# Altium schematic sheet PowerSupply.SchDoc
size A3; SheetNumber: 1; SheetTotal: 9
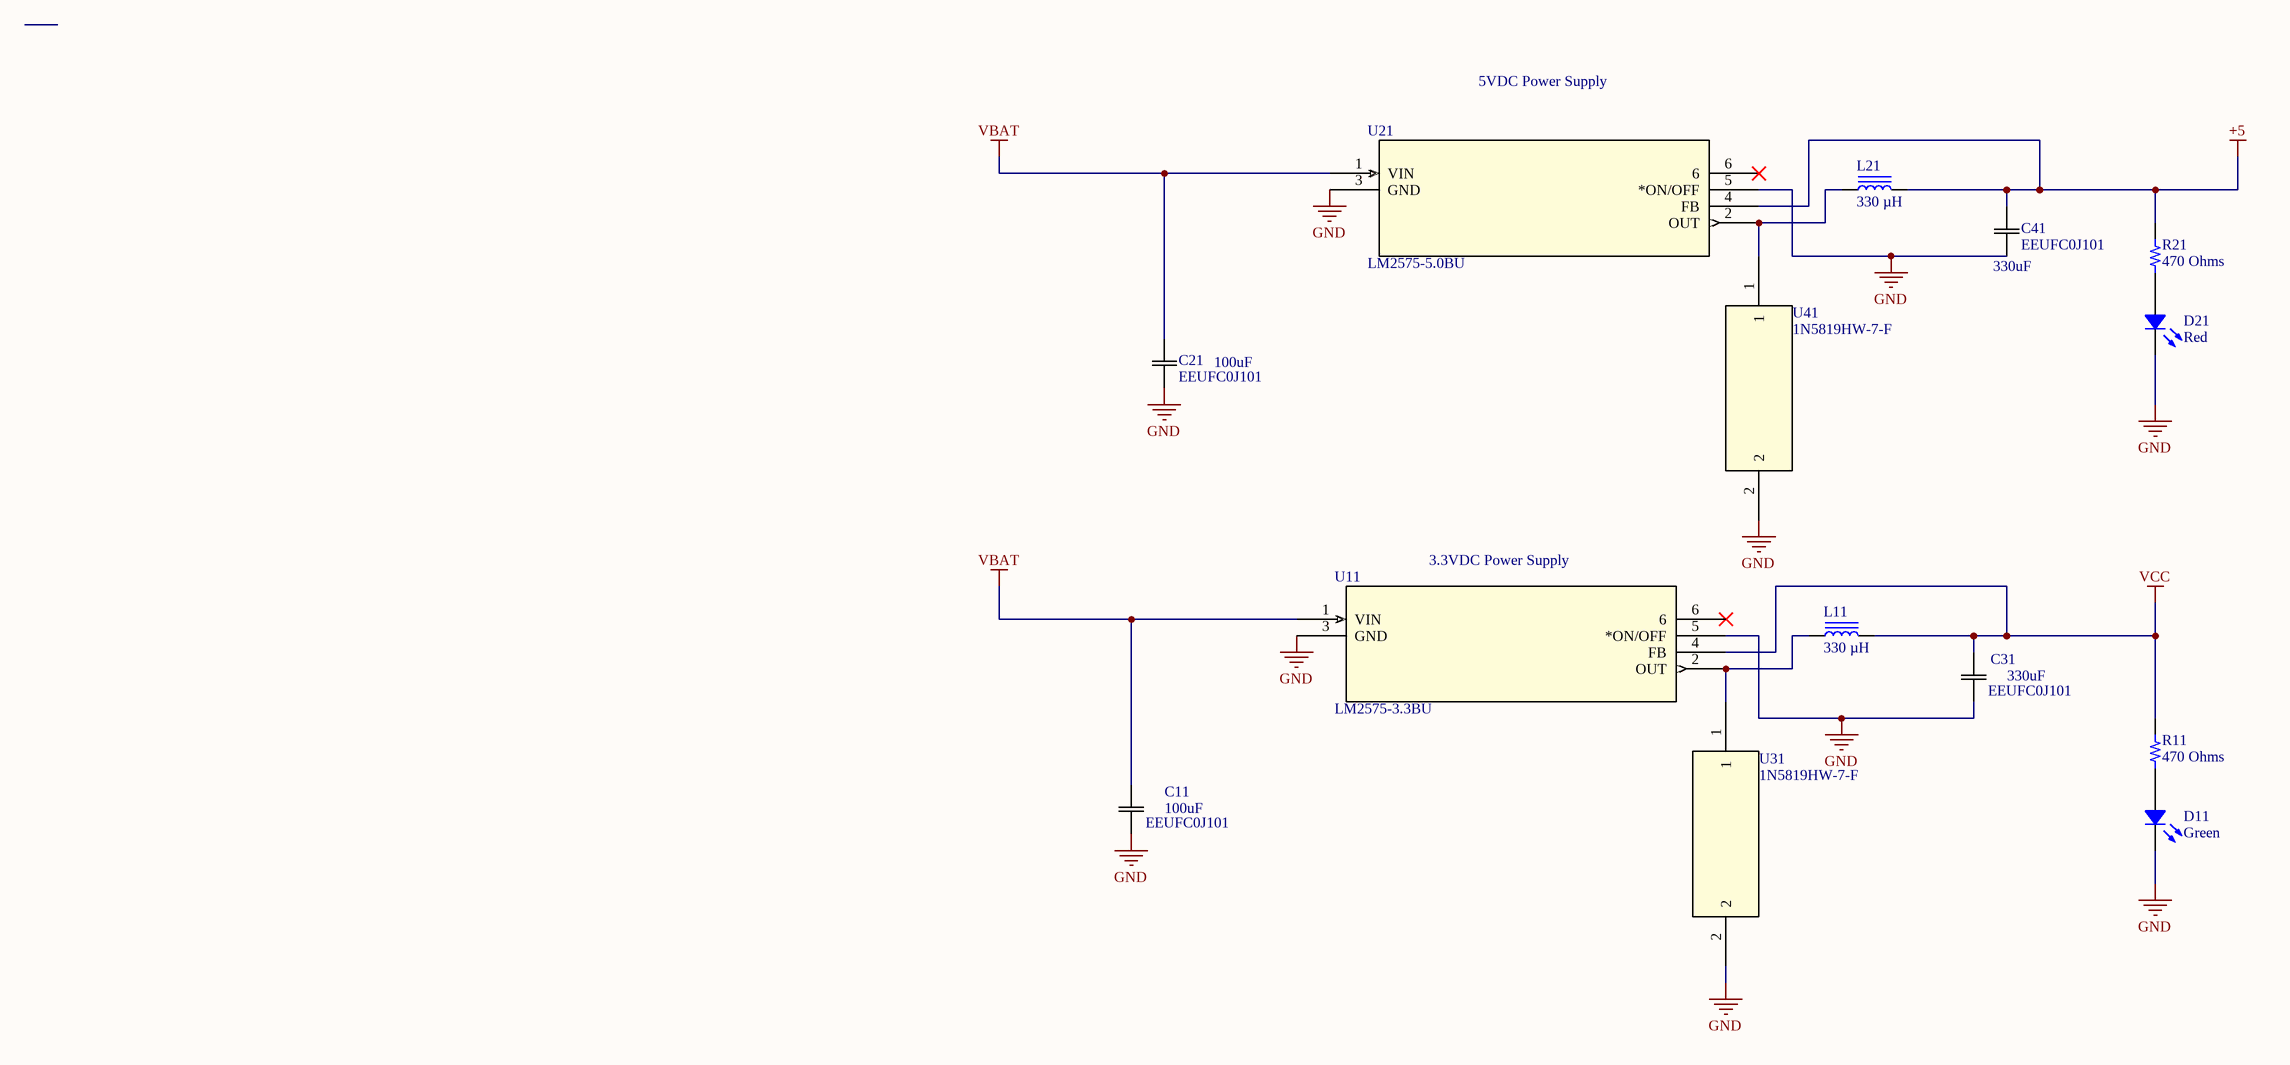
[diagram p0: PowerSupply.SchDoc]

## Parts
C11  EEUFC0J101  value 100uF  [CAP_5 X 11_PAN]
C21  EEUFC0J101  value 100uF  [CAP_5 X 11_PAN]
C31  EEUFC0J101  value 330uF  [CAP_5 X 11_PAN]
C41  EEUFC0J101  value 330uF  [CAP_5 X 11_PAN]
D11  Green  [LED 1206_3216 GREEN]
D21  Red  [LED 1206_3216 RED]
L11  330 µH  [BOURNS SRR1280]
L21  330 µH  [BOURNS SRR1280]
R11  470 Ohms  [RES 0805_2012]
R21  470 Ohms  [RES 0805_2012]
U11  LM2575-3.3BU  [TO-263-5_MCL]
U21  LM2575-5.0BU  [TO-263-5_MCL-M]
U31  1N5819HW-7-F  [1N5819HW-7-F_DIO]
U41  1N5819HW-7-F  [1N5819HW-7-F_DIO]

## Nets
+5: C41.1 L21.2 R21.2 U21.4(FB)
GND: C11.2 C21.2 C31.2 C41.2 D11.2 D21.2 U11.3(GND) U11.5(*ON/OFF) U21.3(GND) U21.5(*ON/OFF) U31.2 U41.2
VBAT: C11.1 C21.1 U11.1(VIN) U21.1(VIN)
VCC: C31.1 L11.2 R11.2 U11.4(FB)
NetD11_1: D11.1 R11.1
NetD21_1: D21.1 R21.1
NetL11_1: L11.1 U11.2(OUT) U31.1
NetL21_1: L21.1 U21.2(OUT) U41.1

Not connected (* = marked no-connect by the designer): U11 6*; U21 6*

## Notes on the sheet
- 5VDC Power Supply
- (near U11) 3.3VDC Power Supply

## Library data of the parts
C11 C21 C31 C41 = EEUFC0J101: No Description Available; Mfr_Name: Panasonic
D11 = 597-6322-107F: LED GREEN 1206 SMD; Manufacturer: Dialight; Current - Test: 20mA; Lens Size: 1.20mm Dia; Lens Style: Round with Domed Top; Millicandela Rating: 1278.5mcd; Viewing Angle: 30°; Voltage - Forward (Vf) (Typ): 3.2V; Wavelength - Dominant: 525nm; Part Number: 597-6322-107F; Color: Green; ComponentLink1Description: Datasheet; ComponentLink1URL: https://s3-us-west-2.amazonaws.com/catsy.557/C18571.pdf; ComponentLink2Description: DigiKey Link; ComponentLink2URL: https://www.digikey.com/en/products/detail/dialight/597-6322-107F/16995758; Device Package: 1206 (3216 Metric); Height (Max): 1.73mm; LastUpdated: 6/3/2024 19:59:09; Lifecycle Status: Active; Minimum Order: 1; Mounting Type: Surface Mount; Package / Case: 1206 (3216 Metric); Packaging: TapeAndReel; PartId: 1292; Part Status: Active; Price: 0.17; Series: -; Size / Dimension: 3.20mm L x 1.60mm W; Supplier 1: DigiKey; Supplier Part Number 1: 350-597-6322-107FCT-ND; Supplier Device Package: 1206; Value: Green
D21 = 25-21/R6C-BR2S2B/2A: LED RED CLEAR 1206 SMD; Manufacturer: Everlight Electronics Co Ltd; Current - Test: 20mA; Lens Color: Colorless; Lens Size: 1.10mm Dia; Lens Style: Round with Domed Top; Millicandela Rating: 212.5mcd; Viewing Angle: 60°; Voltage - Forward (Vf) (Typ): 2.05V; Wavelength - Dominant: 624nm; Wavelength - Peak: 632nm; Part Number: 25-21/R6C-BR2S2B/2A; Color: Red; ComponentLink1Description: Datasheet; ComponentLink1URL: https://everlighteurope.com/index.php?controller=attachment&id_attachment=6134; ComponentLink2Description: DigiKey Link; ComponentLink2URL: https://www.digikey.com/en/products/detail/everlight-electronics-co-ltd/25-21-R6C-BR2S2B-2A/12177238; Device Package: 1206 (3216 Metric); Height (Max): 1.20mm; LastUpdated: 6/3/2024 20:00:40; Lens Transparency: Clear; Lifecycle Status: Active; Minimum Order: 1; Mounting Type: Surface Mount; Package / Case: 1206 (3216 Metric); Packaging: TapeAndReel; PartId: 1100; Part Status: Active; Price: 0.05; Series: -; Size / Dimension: 3.20mm L x 1.60mm W; Supplier 1: DigiKey; Supplier Part Number 1: 1080-25-21/R6C-BR2S2B/2ACT-ND; Supplier Device Package: 1206; Value: Red
L11 L21 = SRR1280-331K: FIXED IND 330UH 1.1A 600MOHM SMD; Manufacturer: Bourns Inc.; Current - Saturation: 1.4A; DC Resistance (DCR): 600mOhm Max; Frequency - Self Resonant: 2.9MHz; Inductance Frequency - Test: 100 kHz; Material - Core: Ferrite; Q @ Freq: 18 @ 796kHz; Shielding: Shielded; Tolerance: ±10%; Type: Drum Core, Wirewound; Part Number: SRR1280-331K; ComponentLink1Description: Datasheet; ComponentLink1URL: https://www.bourns.com/docs/Product-Datasheets/SRR1280.pdf; ComponentLink2Description: DigiKey Link; ComponentLink2URL: https://www.digikey.com/en/products/detail/bourns-inc/SRR1280-331K/1970010; Current Rating (Amps): 1.1 A; Device Package: Nonstandard; Height - Seated (Max): 0.315" (8.00mm); Inductance: 330 µH; LastUpdated: 6/3/2024 20:02:37; Lifecycle Status: Active; Minimum Order: 1; Mounting Type: Surface Mount; Operating Temperature: -40°C ~ 125°C; Package / Case: Nonstandard; Packaging: TapeAndReel; PartId: 35; Part Status: Active; Price: 0.51; Series: SRR1280; Size / Dimension: 0.492" L x 0.492" W (12.50mm x 12.50mm); Supplier 1: DigiKey; Supplier Part Number 1: SRR1280-331KLCT-ND; Value: 330 µH
R11 R21 = AC0805FR-7W470RL: RES 470 OHM 1% 1/4W 0805; Manufacturer: Yageo; Power (Watts): 0.25W, 1/4W; Temperature Coefficient: ±100ppm/°C; Part Number: AC0805FR-7W470RL; Value: 470 Ohms; ComponentLink1Description: Datasheet; ComponentLink1URL: https://www.yageo.com/upload/media/product/productsearch/datasheet/rchip/PYu-AC_51_RoHS_L_9.pdf; ComponentLink2Description: DigiKey Link; ComponentLink2URL: https://www.digikey.com/en/products/detail/yageo/AC0805FR-7W470RL/16982114; Composition: Thick Film; Device Package: 0805 (2012 Metric); Features: Automotive AEC-Q200, Moisture Resistant; Height - Seated (Max): 0.024" (0.60mm); LastUpdated: 2/8/2024 21:00:08; Lifecycle Status: Active; Minimum Order: 1; Number of Terminations: 2; Operating Temperature: -55°C ~ 155°C; Package / Case: 0805 (2012 Metric); Packaging: TapeAndReel; PartId: 76423; Part Status: Active; Price: 0.01; Ratings: AEC-Q200; Resistance: 470 Ohms; Series: AC; Size / Dimension: 0.079" L x 0.049" W (2.00mm x 1.25mm); Supplier 1: DigiKey; Supplier Part Number 1: 13-AC0805FR-7W470RLCT-ND; Supplier Device Package: 0805; Tolerance: ±1%
U11 = LM2575-3.3BU: No Description Available; Mfr_Name: Microchip; RefDes: RefDes; Type: Type; Value: *
U21 = LM2575-5.0BU: No Description Available; Mfr_Name: Microchip; RefDes: RefDes; Type: Type
U31 U41 = 1N5819HW-7-F: No Description Available; Mfr_Name: Diodes Inc; RefDes: RefDes; Type: Type